# EasyEDA Pro project GD32F103C8T6 最小系統.eprj

# Schematic Schematic1
Board Name: Board1; Create Date: 2025-01-16; Page Name: P1; Project Name: GD32F103C8T6 最小系統; Schematic Name: Schematic1; Update Date: 2025-01-16; Company: 嘉立创EDA; Page Size: A4; Version: V1.0
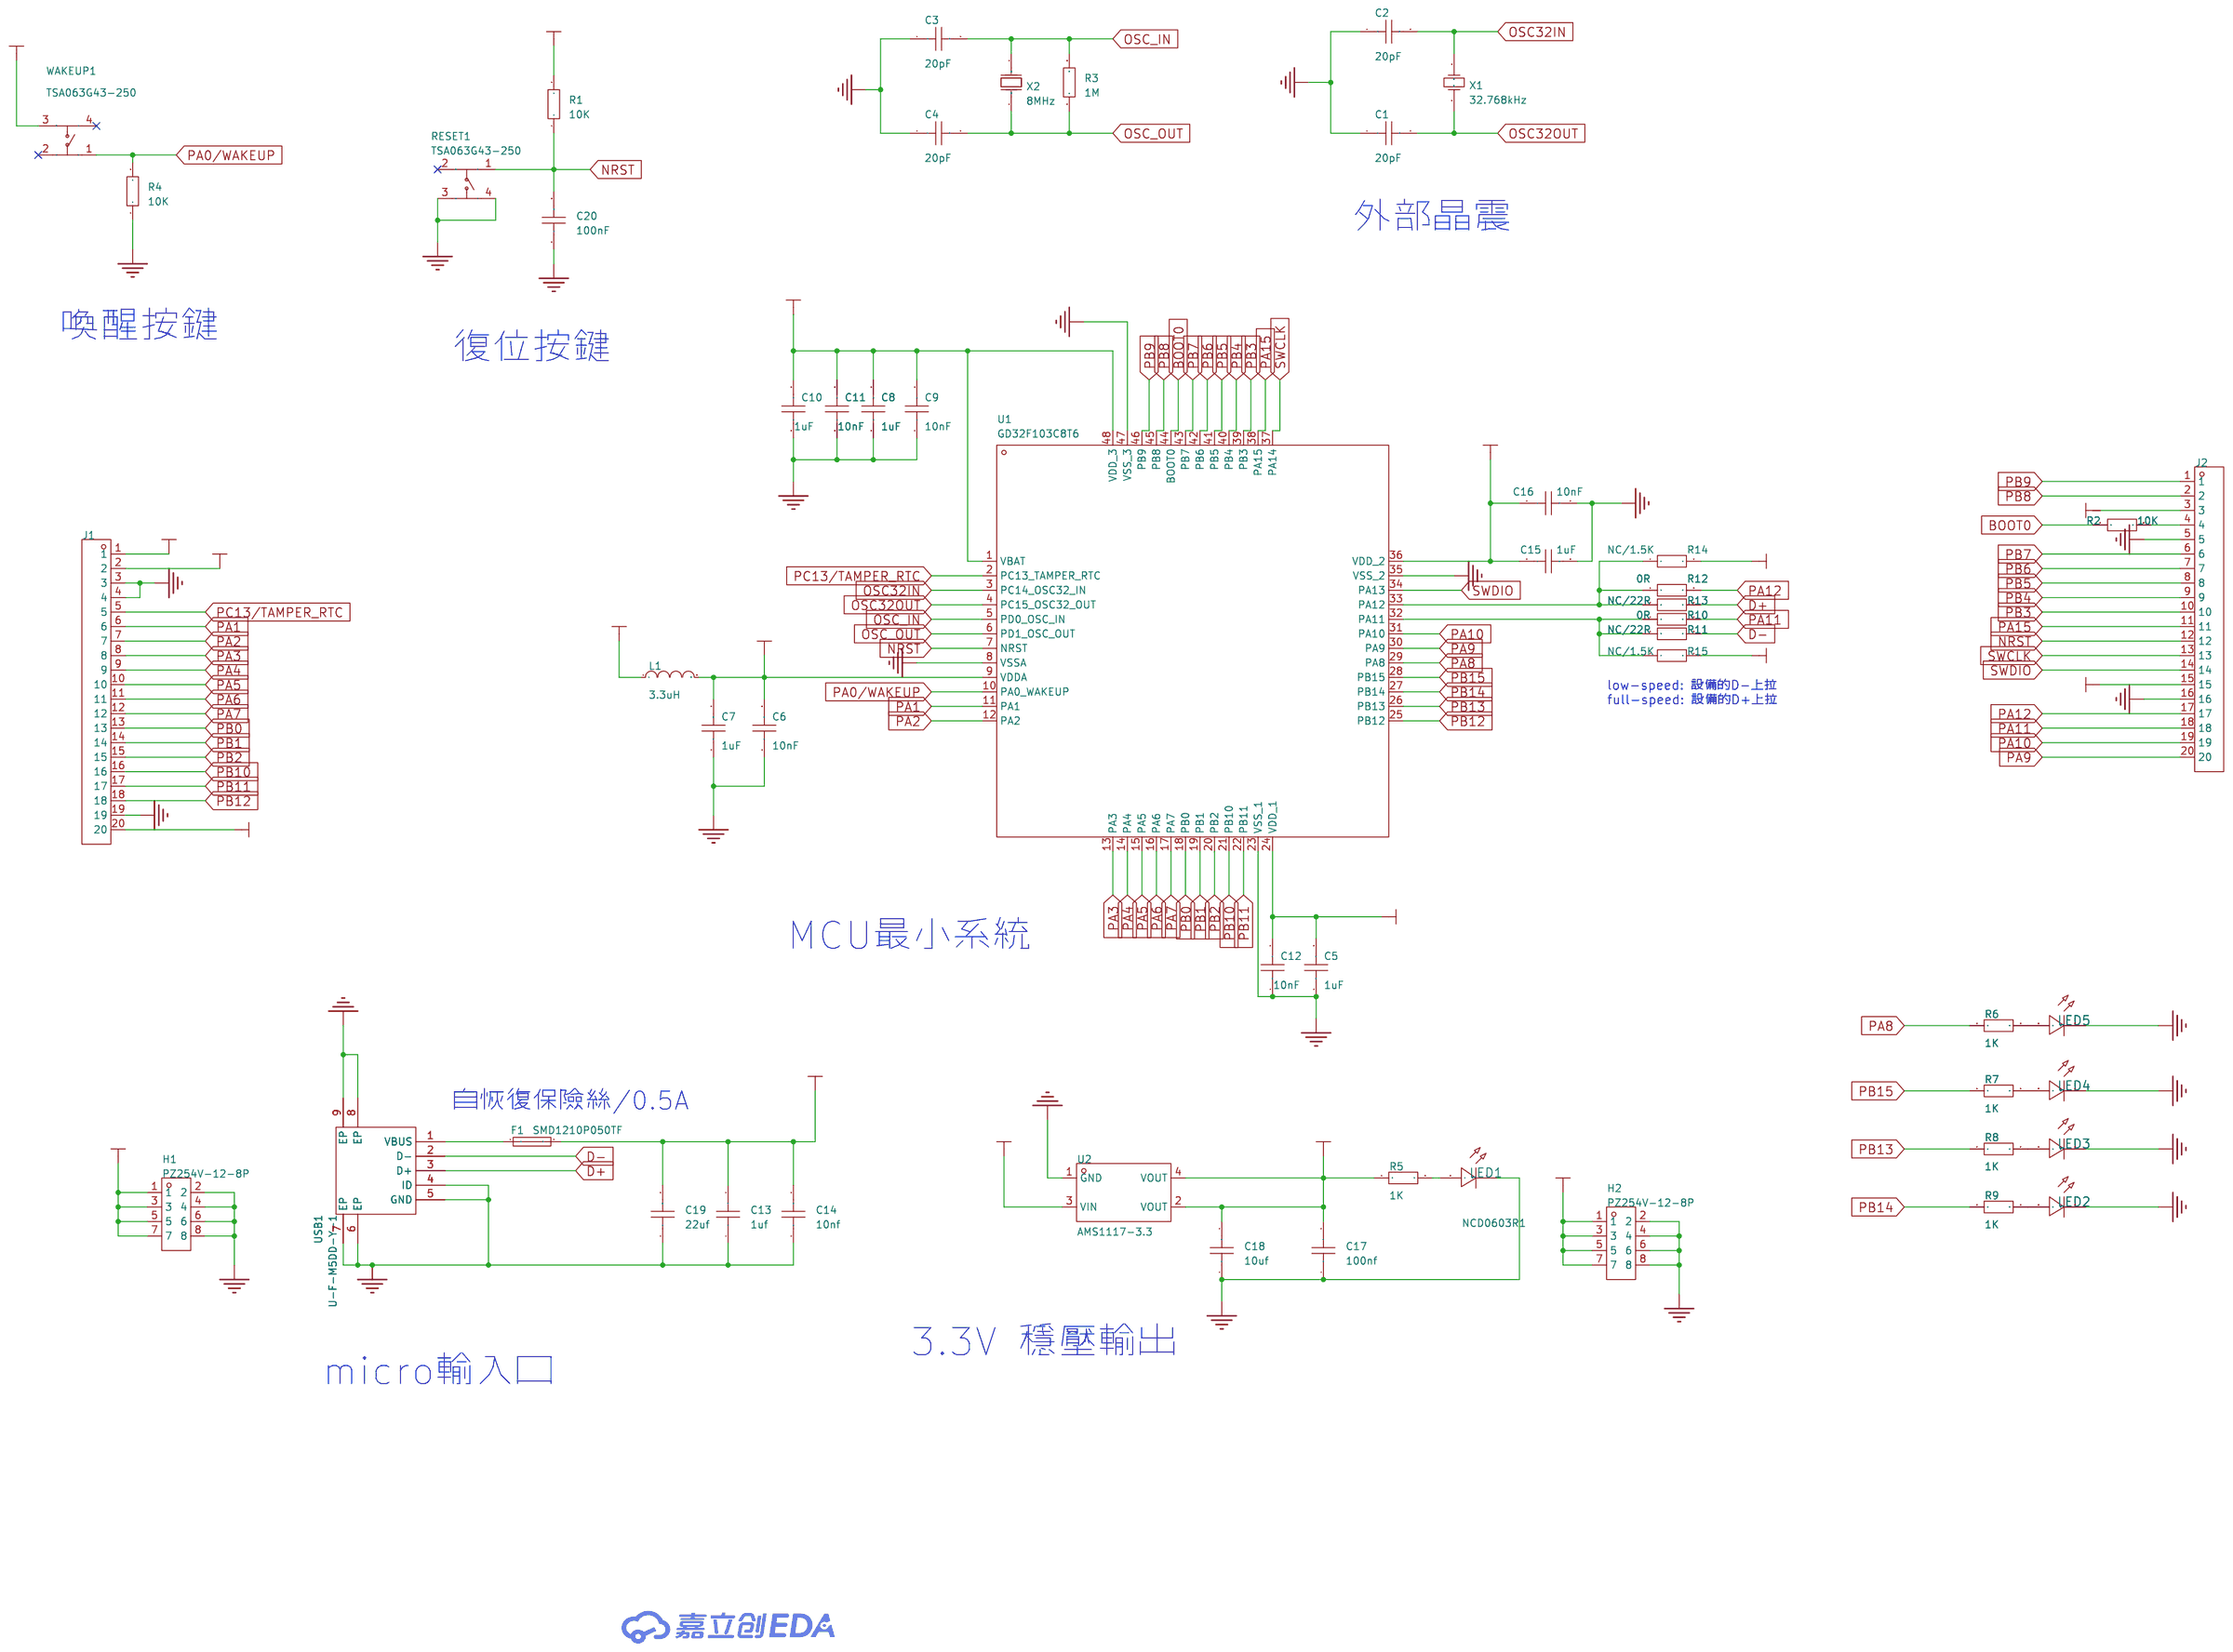
[diagram p0: schematic sheet]

## Parts
C1  20pF  [C0603]
C2  20pF  [C0603]
C3  20pF  [C0603]
C4  20pF  [C0603]
C5  1uF  [C0603]
C6  10nF  [C0603]
C7  1uF  [C0603]
C8  1uF  [C0603]
C9  10nF  [C0603]
C10  1uF  [C0603]
C11  10nF  [C0603]
C12  10nF  [C0603]
C13  1uf  [C0603]
C14  10nf  [C0603]
C15  1uF  [C0603]
C16  10nF  [C0603]
C17  100nf  [C0603]
C18  10uf  [C0805]
C19  22uf  [C0805]
C20  100nF  [C0603]
F1  SMD1210P050TF  [F1210]
H1  PZ254V-12-8P  [HDR-TH_8P-P2.54-V-M-R2-C4-S2.54]
H2  PZ254V-12-8P  [HDR-TH_8P-P2.54-V-M-R2-C4-S2.54]
J1  -  [HDR-TH_20P-P2.54-V-M-1]
J2  -  [HDR-TH_20P-P2.54-V-M-1]
L1  3.3uH  [L0603]
LED1  NCD0603R1  [LED0603-RD_RED]
LED2  NCD0603R1  [LED0603-RD_RED]
LED3  NCD0603R1  [LED0603-RD_RED]
LED4  NCD0603R1  [LED0603-RD_RED]
LED5  NCD0603R1  [LED0603-RD_RED]
R1  10K  [R0603]
R2  10K  [R0603]
R3  1M  [R0603]
R4  10K  [R0603]
R5  1K  [R0603]
R6  1K  [R0603]
R7  1K  [R0603]
R8  1K  [R0603]
R9  1K  [R0603]
R10  0R  [R0603]
R11  NC/22R  [R0603]
R12  0R  [R0603]
R13  NC/22R  [R0603]
R14  NC/1.5K  [R0603]
R15  NC/1.5K  [R0603]
RESET1  TSA063G43-250  [KEY-SMD_4P-L6.0-W6.0-P4.50-LS10.0]
U1  GD32F103C8T6  [TQFP-48_L7.0-W7.0-P0.50-LS9.0-BL]
U2  AMS1117-3.3  [SOT-223-3_L6.5-W3.4-P2.30-LS7.0-BR]
USB1  U-F-M5DD-Y-1  [MICRO-USB-SMD_U-F-M5DD-Y-1]
WAKEUP1  TSA063G43-250  [KEY-SMD_4P-L6.0-W6.0-P4.50-LS10.0]
X1  32.768kHz  [OSC-TH_BD3.1-P0.8-D0.3]
X2  8MHz  [OSC-TH_L10.0-W4.5-P5.00]

## Library data of the parts
C1-C20 = CAP_0603: Supplier Footprint: 0603
F1 = SMD1210P050TF: LCSC Part Name: 0.50A 自恢复型; Supplier Part: C15997; Manufacturer: RUILON(瑞隆源); Supplier Footprint: 1210; JLCPCB Part Class: 扩展库; Datasheet: https://atta.szlcsc.com/upload/public/pdf/source/20200427/C15997_F0890E2A0329AD76630862C098BA0840.pdf; Supplier: LCSC; Operating Voltage (Max): 13.2V; Current Rating (Max): 100A; Hold Current: 500mA; Trip Current: 1A
H1 H2 = PZ254V-12-8P: LCSC Part Name: 间距:2.54mm 2x4P 直插 方针; Supplier Part: C492421; Manufacturer: XFCN(兴飞); Supplier Footprint: 插件,P=2.54mm; JLCPCB Part Class: 扩展库; Datasheet: https://atta.szlcsc.com/upload/public/pdf/source/20200309/C492421_DC8A206AF99CD7755BD4A5B0BC48200B.pdf; Supplier: LCSC; Pin Structure: 2x4P; Pitch: 2.54mm; Row Spacing: 2.54mm; Circluar Pins/Square Pins: 方针; Mounting Type: 直插; Number of Rows: 双排; Number of Pins: 8P; Length of Mating Pin: 6mm; Insulation Height: 2.5mm; Length of End Connection Pin: 3mm; Contact Material: 黄铜; Operating Temperature Range: -40℃~+105℃; Color: 黑色
J1 J2 = HDR-M_2.54_1x20P: Supplier Part: C50981; Supplier Footprint: 插件
L1 = L_0603
LED1-LED5 = NCD0603R1_C84263: Supplier Part: C84263; Manufacturer: 国星光电; Supplier Footprint: 0603; JLCPCB Part Class: Extended Part; Datasheet: https://atta.szlcsc.com/upload/public/pdf/source/20200820/C84263_DABC6A75E58F576973B407FDBA283D60.pdf; Supplier: LCSC; Emitted Color: 红色; Forward Voltage (VF): 1.6V~2.6V; Power Dissipation: 65mW; Forward Current: 20mA; Dominant Wavelength: 615nm~630nm; Diode Configuration: 独立二极管; Lens Color: 无色透明透镜; Luminous Intensity: 80mcd~220mcd; Viewing Angle: 130°; Operating Temperature: -30℃~+85℃
R1-R15 = Res_0603: Supplier Footprint: 0603
RESET1 WAKEUP1 = TSA063G43-250: LCSC Part Name: 6.1*6.1*4.3mm 立贴 轻触开关; Supplier Part: C294564; Manufacturer: BRIGHT(博瑞泰); Supplier Footprint: SMD; JLCPCB Part Class: Extended Part; Datasheet: https://atta.szlcsc.com/upload/public/pdf/source/20181029/C294570_15EFF1F4D215547575AD6307D8A439BB.pdf; Supplier: LCSC; Circuit: 单刀单掷; Actuator Style: 圆形按钮; Operating Force: 250gf; Mounting Style: 立贴; Switch Length: 6.1mm; Switch Width: 6.1mm; Switch Height: 4.3mm; Strike Gundam: 不带; Contact Current: 50mA; Voltage Rating (DC): 12V; Insulation Resistance: 100MΩ; Actuator/Cap Color: 黑色; With Lamp: 无; Pin Style: 鸥翼型; Mechanical Life: 5万次; Operating Temperature: -25℃~+70℃
U1 = GD32F103C8T6: LCSC Part Name: Arm® Cortex®-M3 32-bit MCU; Supplier Part: C77994; Manufacturer: GigaDevice(兆易创新); Supplier Footprint: LQFP-48(7x7); JLCPCB Part Class: Extended Part; Datasheet: https://atta.szlcsc.com/upload/public/pdf/source/20160910/1473490296871.pdf; Supplier: LCSC; CPU Core: CM3; Program Storage Size: 64KB; RAM Size: 20KB; GPIO Ports Number: 37; Operating Voltage Range: 2.6V~3.6V; CPU Maximum Speed: 108MHz; Program Memory Type: FLASH; Operating Temperature Range: -40℃~+85℃; ADC (Bit): 12bit; PWM (Bit): 16bit; 16Bit Timer: 3; CAN: 1; UART/USART: 3; I2C: 2; SPI: 2; Universal Serial Bus: 有; Peripheral/Function: 片载温度传感器；DMA；看门狗；LIN总线协议；PWM；IrDA；SDIO；RTC实时时钟; Watchdog: 有; Real-Time Clock: 有; Infrared Data Association: 有; Secure Digital Input and Output: 有; Direct Memory Access: 有; Internal Oscillator: 有
U2 = AMS1117-3.3_C6186: 输出类型:固定;最大输入电压:-;输出电压:3.3V;最大输出电流:1A;电源纹波抑制比(PSRR):72dB@(120Hz);输出极性:正极;; LCSC Part Name: 输出3.3V 1A; Supplier Part: C6186; Manufacturer: AMS; Supplier Footprint: SOT-223; JLCPCB Part Class: Basic Part; Datasheet: https://atta.szlcsc.com/upload/public/pdf/source/20180727/C6186_7A095716F0823C02F1997A905E26C086.pdf; Supplier: LCSC; Output Type: 固定; Output Voltage: 3.3V; MAX Output Current: 1A; Power Supply Rejection Ratio (PSRR): 72dB@(120Hz); Dropout Voltage: 1.3V@(800mA); Output Polarity: 正极; Number of Outputs: 1
USB1 = U-F-M5DD-Y-1: LCSC Part Name: Micro-B 母; Supplier Part: C91467; Manufacturer: 韩国韩荣; Supplier Footprint: SMD; JLCPCB Part Class: Extended Part; Datasheet: https://atta.szlcsc.com/upload/public/pdf/source/20190321/C91467_7D0E0328BDB3D0105DB79E7E785438EE.pdf; Supplier: LCSC; Connector Type: Micro-B; Standard: USB 2.0; Gender: 母; Number of Ports: 1; Number of Contacts: 5P; Current Rating - Power (Max): 1A
X1 = X308032768KGB2SC: LCSC Part Name: 32.768kHz ±10ppm 12.5pF YT-38; Supplier Part: C52082; Manufacturer: YXC(扬兴晶振); Supplier Footprint: DT-38; JLCPCB Part Class: Extended Part; Datasheet: https://atta.szlcsc.com/upload/public/pdf/source/20240329/231E1A1EB7C875CD193DBE6664A3DE3A.pdf; Supplier: LCSC; Crystal Type: 直插晶振; Normal temperature Frequency Tolerance: ±10ppm; External load capacitor: 12.5pF; Operating Temperature: -20℃~+70℃
X2 = X49SD8MSD2SC: LCSC Part Name: 8MHz ±20ppm 20pF; Supplier Part: C21263; Manufacturer: YXC(扬兴晶振); Supplier Footprint: HC-49S; JLCPCB Part Class: 扩展库; Datasheet: https://atta.szlcsc.com/upload/public/pdf/source/20240329/977D7F2434F98B2BE33270BB9FF3D86D.pdf; Supplier: LCSC; Crystal Type: 直插晶振; Normal temperature Frequency Tolerance: ±20ppm; External load capacitor: 20pF; Frequency Stability(Full temperature range): ±30ppm; Operating Temperature: -20℃~+70℃

## Nets
GND: C1.1 C2.1 C3.1 C4.1 C5.1 C6.1 C7.1 C8.1 C9.1 C10.1 C11.1 C12.1 C13.1 C14.1 C15.2 C16.2 C17.1 C18.1 C19.1 C20.1 H1.2 H1.4 H1.6 H1.8 H2.2 H2.4 H2.6 H2.8 J1.3 J1.4 J1.19 J2.5 J2.16 LED1.1(C) LED2.1(C) LED3.1(C) LED4.1(C) LED5.1(C) R4.1 RESET1.3 RESET1.4 U1.8(VSSA) U1.23(VSS_1) U1.35(VSS_2) U1.47(VSS_3) U2.1(GND) USB1.4(ID) USB1.5(GND) USB1.6(EP) USB1.7(EP) USB1.8(EP) USB1.9(EP)
VCC_3V3: C5.2 C8.2 C9.2 C10.2 C11.2 C12.2 C15.1 C16.1 C17.2 C18.2 H2.1 H2.3 H2.5 H2.7 J1.1 J1.20 J2.3 J2.15 L1.1 R1.2 R5.1 R14.2 R15.2 U1.1(VBAT) U1.24(VDD_1) U1.36(VDD_2) U1.48(VDD_3) U2.2(VOUT) U2.4(VOUT) WAKEUP1.3
VDDA: C6.2 C7.2 J1.2 L1.2 U1.9(VDDA)
VIN_5V: C13.2 C14.2 C19.2 F1.2 H1.1 H1.3 H1.5 H1.7 U2.3(VIN)
BOOT0: R2.1 U1.44(BOOT0)
D+: R13.2 USB1.3(D+)
D-: R11.2 USB1.2(D-)
NRST: C20.2 J2.12 R1.1 RESET1.1 U1.7(NRST)
OSC32IN: C2.2 U1.3(PC14_OSC32_IN) X1.1(OSC1)
OSC32OUT: C1.2 U1.4(PC15_OSC32_OUT) X1.2(OSC2)
OSC_IN: C3.2 R3.2 U1.5(PD0_OSC_IN) X2.2(OSC2)
OSC_OUT: C4.2 R3.1 U1.6(PD1_OSC_OUT) X2.1(OSC1)
PA0/WAKEUP: R4.2 U1.10(PA0_WAKEUP) WAKEUP1.1
PA1: J1.6 U1.11(PA1)
PA2: J1.7 U1.12(PA2)
PA3: J1.8 U1.13(PA3)
PA4: J1.9 U1.14(PA4)
PA5: J1.10 U1.15(PA5)
PA6: J1.11 U1.16(PA6)
PA7: J1.12 U1.17(PA7)
PA8: R6.1 U1.29(PA8)
PA9: J2.20 U1.30(PA9)
PA10: J2.19 U1.31(PA10)
PA11: J2.18 R10.2
PA12: J2.17 R12.2
PA15: J2.11 U1.38(PA15)
PB0: J1.13 U1.18(PB0)
PB1: J1.14 U1.19(PB1)
PB2: J1.15 U1.20(PB2)
PB3: J2.10 U1.39(PB3)
PB4: J2.9 U1.40(PB4)
PB5: J2.8 U1.41(PB5)
PB6: J2.7 U1.42(PB6)
PB7: J2.6 U1.43(PB7)
PB8: J2.2 U1.45(PB8)
PB9: J2.1 U1.46(PB9)
PB10: J1.16 U1.21(PB10)
PB11: J1.17 U1.22(PB11)
PB12: J1.18 U1.25(PB12)
PB13: R8.1 U1.26(PB13)
PB14: R9.1 U1.27(PB14)
PB15: R7.1 U1.28(PB15)
PC13/TAMPER_RTC: J1.5 U1.2(PC13_TAMPER_RTC)
SWCLK: J2.13 U1.37(PA14)
SWDIO: J2.14 U1.34(PA13)
$1N505: LED1.2(A) R5.2
$1N1125: F1.1 USB1.1(VBUS)
$1N3914: R12.1 R13.1 R14.1 U1.33(PA12)
$1N3945: R10.1 R11.1 R15.1 U1.32(PA11)
$1N6882: J2.4 R2.2
$1N7531: LED5.2(A) R6.2
$1N7558: LED4.2(A) R7.2
$1N7585: LED3.2(A) R8.2
$1N7612: LED2.2(A) R9.2

Not connected (* = marked no-connect by the designer): RESET1 2*; WAKEUP1 2* 4*

## Notes on the sheet
- 外部晶震
- 喚醒按鍵
- 復位按鍵
- low-speed: 設備的D-上拉
- full-speed: 設備的D+上拉
- MCU最小系統
- 自恢復保險絲/0.5A
- 3.3V 穩壓輸出
- micro輸入口

# Board PCB1
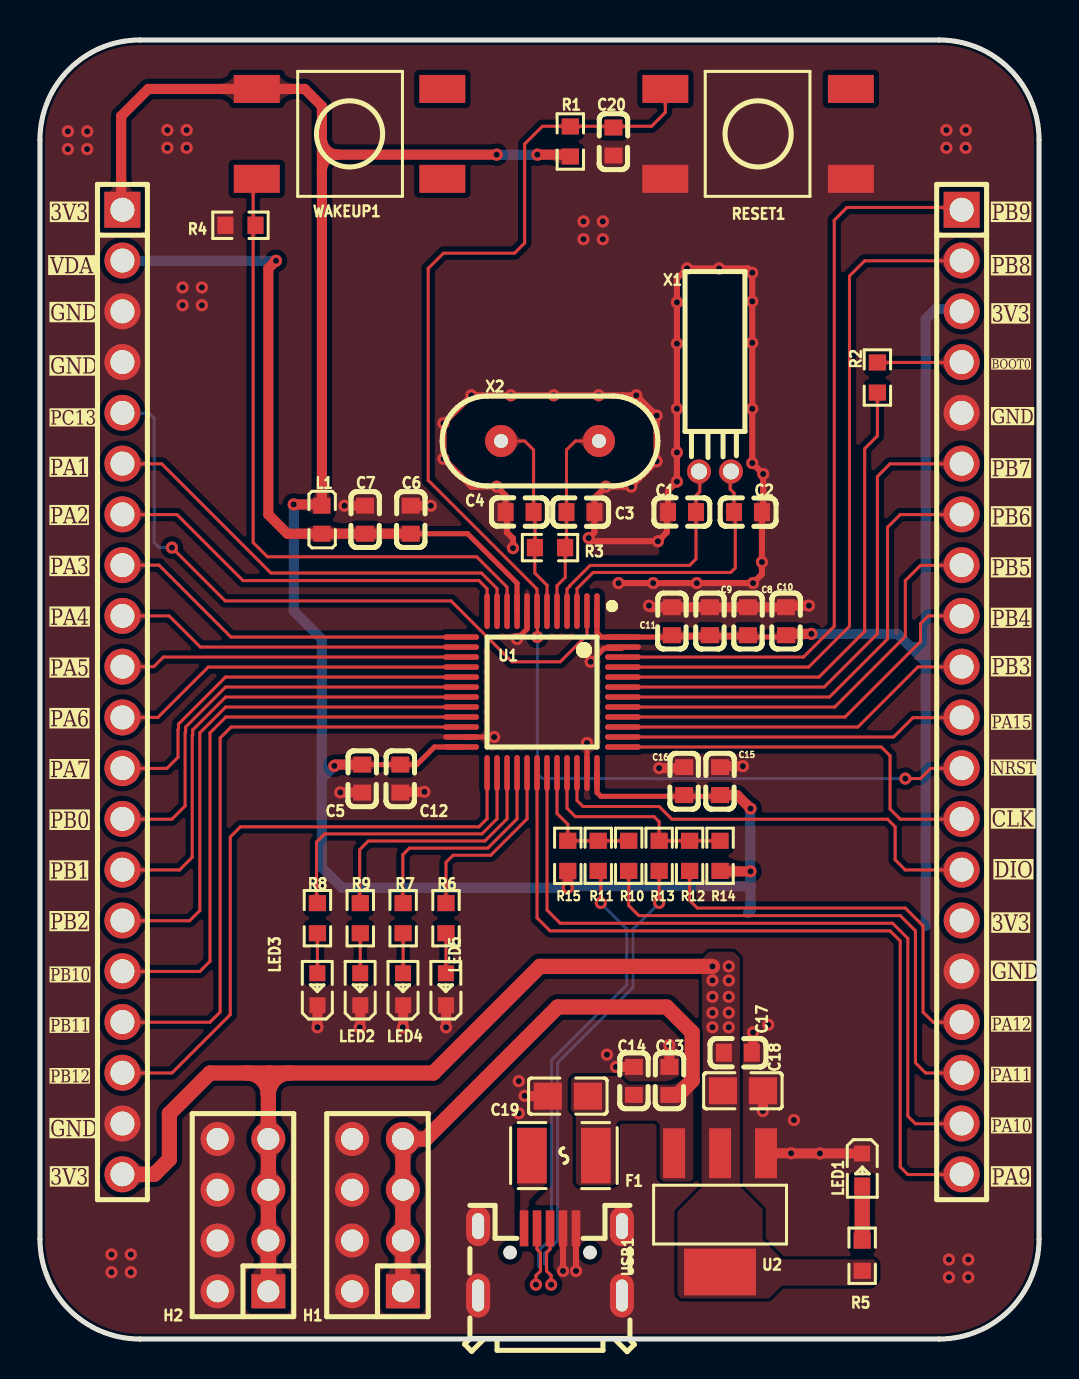
[diagram p1: board, top side]
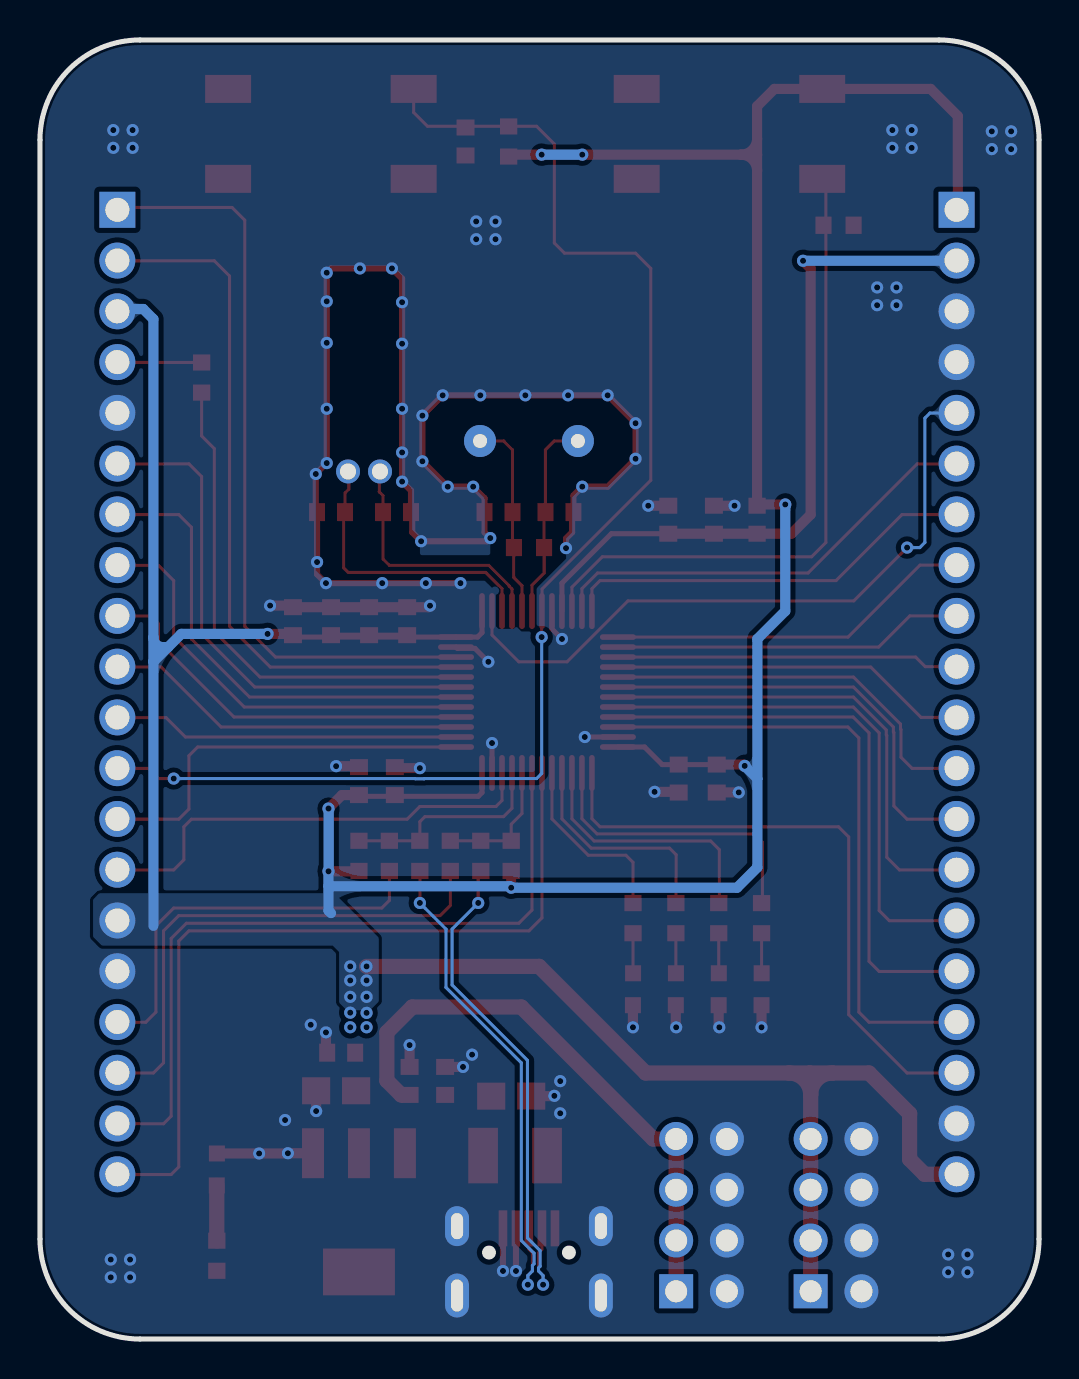
[diagram p2: board, bottom side, seen from below]

Outline 50 x 65 mm; copper layers: Top Layer, Bottom Layer. Coordinates in mm from the lower left corner of the outline.
Outline path: 0,60 0,5 arc(1.46,1.46) 5,0 45,0 arc(48.54,1.46) 50,5 50,60 arc(48.54,63.54) 45,65 5,65 arc(1.46,63.54) 0,60
Stack: Top Layer 0.035mm / Dielectric1 1.51mm FR4 er 4.5 / Bottom Layer 0.035mm

## Design rules (mm)
net GND: pwr
net VCC_3V3: pwr
net VDDA: pwr
net VIN_5V: pwr
net $1N1125: pwr
net D-: DP1
net D+: DP1
template: 自定义配置
spacing copperThickness1oz (default): track to track 0.203, other pairs 0.152 to 0.3
spacing copperThickness2oz: track to track 0.203, other pairs 0.152 to 0.3
track width copperThickness1oz (default): min 0.152, default 0.152, max 2.54
track width copperThickness2oz: min 0.152, default 0.254, max 2.54
track width pwr: min 0.254, default 0.508, max 2.54
differential pair differentialPair (default): width min 0.152, default 0.152, max 0.152; gap min 0.152, default 0.152
via viaSize (default): diameter min 0.5, default 0.61, max 10; hole min 0.3, default 0.305, max 6.299
net class pwr uses pwr
net GND uses pwr
net VCC_3V3 uses pwr
net VDDA uses pwr
net VIN_5V uses pwr
net $1N1125 uses pwr

## Placement (name value [footprint] x y rotation side)
C1  20pF  [C0603]  32.13 41.38 0 top
C2  20pF  [C0603]  35.43 41.38 180 top
C3  20pF  [C0603]  27.05 41.38 180 top
C4  20pF  [C0603]  24 41.38 0 top
C5  1uF  [C0603]  16.13 28.04 90 top
C6  10nF  [C0603]  18.56 41 270 top
C7  1uF  [C0603]  16.27 41 270 top
C8  1uF  [C0603]  35.43 35.92 270 top
C9  10nF  [C0603]  33.53 35.92 270 top
C10  1uF  [C0603]  37.34 35.92 270 top
C11  10nF  [C0603]  31.62 35.92 270 top
C12  10nF  [C0603]  18.03 28.04 90 top
C13  1uf  [C0603]  31.5 12.91 270 top
C14  10nf  [C0603]  29.72 12.91 270 top
C15  1uF  [C0603]  34.04 27.92 90 top
C16  10nF  [C0603]  32.24 27.92 90 top
C17  100nf  [C0603]  34.92 14.33 180 top
C18  10uf  [C0805]  35.18 12.42 180 top
C19  22uf  [C0805]  26.42 12.15 0 top
C20  100nF  [C0603]  28.7 59.92 90 top
F1  SMD1210P050TF  [F1210]  26.22 9.18 0 top
H1  PZ254V-12-8P  [HDR-TH_8P-P2.54-V-M-R2-C4-S2.54]  16.89 6.2 90 top
H2  PZ254V-12-8P  [HDR-TH_8P-P2.54-V-M-R2-C4-S2.54]  10.16 6.2 90 top
J1  -  [HDR-TH_20P-P2.54-V-M-1]  4.13 32.37 270 top
J2  -  [HDR-TH_20P-P2.54-V-M-1]  46.13 32.37 270 top
L1  3.3uH  [L0603]  14.11 41 270 top
LED1  NCD0603R1  [LED0603-RD_RED]  41.15 8.48 270 top
LED2  NCD0603R1  [LED0603-RD_RED]  16.03 17.5 90 top
LED3  NCD0603R1  [LED0603-RD_RED]  13.89 17.5 90 top
LED4  NCD0603R1  [LED0603-RD_RED]  18.17 17.5 90 top
LED5  NCD0603R1  [LED0603-RD_RED]  20.32 17.5 90 top
R1  10K  [R0603]  26.54 59.92 270 top
R2  10K  [R0603]  41.91 48.11 90 top
R3  1M  [R0603]  25.53 39.6 0 top
R4  10K  [R0603]  10.03 55.73 0 top
R5  1K  [R0603]  41.15 4.17 90 top
R6  1K  [R0603]  20.32 21.06 270 top
R7  1K  [R0603]  18.17 21.06 270 top
R8  1K  [R0603]  13.89 21.06 270 top
R9  1K  [R0603]  16.03 21.06 270 top
R10  0R  [R0603]  29.46 24.18 270 top
R11  NC/22R  [R0603]  27.94 24.18 270 top
R12  0R  [R0603]  32.51 24.18 270 top
R13  NC/22R  [R0603]  30.99 24.18 270 top
R14  NC/1.5K  [R0603]  34.04 24.18 270 top
R15  NC/1.5K  [R0603]  26.42 24.18 270 top
RESET1  TSA063G43-250  [KEY-SMD_4P-L6.0-W6.0-P4.50-LS10.0]  35.94 60.3 270 top
U1  GD32F103C8T6  [TQFP-48_L7.0-W7.0-P0.50-LS9.0-BL]  25.13 32.37 180 top
U2  AMS1117-3.3  [SOT-223-3_L6.5-W3.4-P2.30-LS7.0-BR]  34.04 6.33 90 top
USB1  U-F-M5DD-Y-1  [MICRO-USB-SMD_U-F-M5DD-Y-1]  25.53 3.91 270 top
WAKEUP1  TSA063G43-250  [KEY-SMD_4P-L6.0-W6.0-P4.50-LS10.0]  15.49 60.3 90 top
X1  32.768kHz  [OSC-TH_BD3.1-P0.8-D0.3]  33.78 43.41 270 top
X2  8MHz  [OSC-TH_L10.0-W4.5-P5.00]  25.53 44.93 90 top

## Footprints (pads in the part's own frame, mm; a bottom-side part is the same pattern mirrored in y, then rotated)
C0603
  rect 0.8x0.9 smd: 1(-0.7,0) 2(0.7,0)
C0805
  rect 1.41x1.35 smd: 1(-1,0) 2(1,0)
F1210
  rect 1.485x2.781 smd: 1(-1.6,0) 2(1.6,0)
HDR-TH_8P-P2.54-V-M-R2-C4-S2.54
  rect 1.7x1.7 hole 1.1: 1(-3.81,-1.27)
  round 1.7 hole 1.1: 2(-3.81,1.27) 3(-1.27,-1.27) 4(-1.27,1.27) 5(1.27,-1.27) 6(1.27,1.27) 7(3.81,-1.27) 8(3.81,1.27)
HDR-TH_20P-P2.54-V-M-1
  rect 1.8x1.8 hole 1.2: 1(-24.13,0)
  round 1.8 hole 1.2: 2(-21.59,0) 3(-19.05,0) 4(-16.51,0) 5(-13.97,0) 6(-11.43,0) 7(-8.89,0) 8(-6.35,0) 9(-3.81,0) 10(-1.27,0) 11(1.27,0) 12(3.81,0) 13(6.35,0) 14(8.89,0) 15(11.43,0) 16(13.97,0) 17(16.51,0) 18(19.05,0) 19(21.59,0) 20(24.13,0)
KEY-SMD_4P-L6.0-W6.0-P4.50-LS10.0
  rect 1.4x2.3 smd: 1(-2.25,-4.643) 2(-2.25,4.643) 3(2.25,4.643) 4(2.25,-4.643)
L0603
  rect 0.8x0.864 smd: 1(-0.7,0) 2(0.7,0)
LED0603-RD_RED
  rect 0.8x0.8 smd: 1(-0.799,-0.004) 2(0.799,0.004)
MICRO-USB-SMD_U-F-M5DD-Y-1
  rect 1.8x0.43 smd: 1(-1.626,-1.3) 2(-1.626,-0.65) 3(-1.626,0) 4(-1.626,0.65) 5(-1.626,1.3)
  oval 2x1.2 hole 1.3x0.6: 6(-1.735,3.599) 8(-1.735,-3.599)
  oval 2.2x1.2 hole 1.6x0.6: 7(1.735,3.599) 9(1.735,-3.599)
OSC-TH_BD3.1-P0.8-D0.3
  round 1.2 hole 0.8: 1(0,0.8) 2(0,-0.8)
OSC-TH_L10.0-W4.5-P5.00
  round 1.6 hole 0.7: 1(0,2.45) 2(0,-2.45)
R0603
  rect 0.806x0.864 smd: 1(-0.753,0) 2(0.753,0)
SOT-223-3_L6.5-W3.4-P2.30-LS7.0-BR
  rect 2.5x1.1 smd: 1(2.97,-2.3) 2(2.97,0) 3(2.97,2.3)
  rect 2.34x3.6 smd: 4(-2.97,0)
TQFP-48_L7.0-W7.0-P0.50-LS9.0-BL
  oval 0.28x1.8 smd: 1(-2.75,-4.05) 2(-2.25,-4.05) 3(-1.75,-4.05) 4(-1.25,-4.05) 5(-0.75,-4.05) 6(-0.25,-4.05) 7(0.25,-4.05) 8(0.75,-4.05) 9(1.25,-4.05) 10(1.75,-4.05) 11(2.25,-4.05) 12(2.75,-4.05) 25(2.75,4.05) 26(2.25,4.05) 27(1.75,4.05) 28(1.25,4.05) 29(0.75,4.05) 30(0.25,4.05) 31(-0.25,4.05) 32(-0.75,4.05) 33(-1.25,4.05) 34(-1.75,4.05) 35(-2.25,4.05) 36(-2.75,4.05)
  oval 1.8x0.28 smd: 13(4.05,-2.75) 14(4.05,-2.25) 15(4.05,-1.75) 16(4.05,-1.25) 17(4.05,-0.75) 18(4.05,-0.25) 19(4.05,0.25) 20(4.05,0.75) 21(4.05,1.25) 22(4.05,1.75) 23(4.05,2.25) 24(4.05,2.75) 37(-4.05,2.75) 38(-4.05,2.25) 39(-4.05,1.75) 40(-4.05,1.25) 41(-4.05,0.75) 42(-4.05,0.25) 43(-4.05,-0.25) 44(-4.05,-0.75) 45(-4.05,-1.25) 46(-4.05,-1.75) 47(-4.05,-2.25) 48(-4.05,-2.75)

## Nets
As in the schematic, except:
PA0/WAKEUP: R4.2 U1.10 WAKEUP1.2

Pads without a net: RESET1 2; WAKEUP1 1 4

## Via types
v1: diameter 0.61, hole 0.305, Top Layer to Bottom Layer, 117 vias

## Routing (per net, layer and track width the routed paths; a pad name or vN(x,y) marks a point on that pad's centre or on a via; arc(x,y) is an arc through that point)
GND: length 112.4
  Top Layer w0.254: U1.47 29.11,34.56 28.23,34.56 v1(27.56,33.88) ; U1.23 v1(22.73,30.12) ; v1(23.88,35.03) 24.38,35.53 U1.8 ; U1.35 v1(27.38,29.82)
  Top Layer w0.305: USB1.5 v1(26.83,3.41) ; v1(23.67,39.57) 23.67,40.06 23.37,40.36 23.37,41.31 C4.1 23.3,42.2 v1(22.86,42.65) 21.59,42.65 v1(20.19,44.04) v1(20.19,45.82) v1(21.59,47.22) v1(23.57,47.22) v1(25.71,47.22) v1(27.96,47.22) v1(29.84,47.22) v1(30.86,46.2) v1(30.86,43.92) v1(29.59,42.65) v1(28.32,42.65) 27.75,42.08 27.75,40.36 v1(27.46,40.08) 27.62,39.92 v1(30.92,39.92) 31.37,40.36 31.37,41.31 31.43,41.37 31.43,42.46 v1(31.88,42.9) v1(31.88,44.36) v1(31.88,46.55) v1(31.88,49.8) v1(31.88,51.88) 31.88,53.06 v1(32.39,53.57) v1(33.99,53.57) 35.43,53.57 v1(35.65,53.35) v1(35.65,51.92) v1(35.65,49.85) v1(35.65,46.55) v1(35.65,43.83) v1(36.2,43.28) 36.2,41.44 C2.1 v1(36.13,38.88) 36.13,38.27 v1(35.69,37.82) v1(32.87,37.82) v1(30.69,37.82) v1(28.96,37.82) ; USB1.4 v1(26.18,3.41)
  Top Layer w0.508: LED4.1 18.18,15.61 v1(18.16,15.6) ; C7.1 v1(15.24,41.7) ; 16.24,27.35 v1(15.03,27.35) ; v1(19.24,27.38) 18.03,27.38 17.91,27.25 ; 37.53,36.57 37.66,36.7 v1(38.48,36.7) ; C14.1 v1(28.83,13.61) ; C17.1 35.69,14.39 v1(35.69,15.34) ; v1(16,15.6) 16.03,15.63 LED2.1 ; v1(30.48,36.69) 30.56,36.62 C9.1 C8.1 C10.1 ; LED5.1 v1(20.32,15.6) ; 32.19,28.56 v1(30.99,28.56) ; LED3.1 v1(13.89,15.6) ; C6.1 v1(19.56,41.7) ; C13.1 v1(31.5,14.71) ; C18.1 v1(36.18,11.41) ; 33.97,28.66 v1(35.18,28.66) ; v1(24.26,12.17) 24.27,12.15 C19.1 ; 36.46,9.3 v1(37.59,9.3) 37.6,9.28 v1(39.03,9.28) LED1.1 ; 37.4,36.7 37.41,36.69
  vias: v1(1.4,60.43) v1(1.4,59.54) v1(2.36,60.43) v1(2.36,59.54) v1(3.58,4.23) v1(3.58,3.34) v1(4.55,4.23) v1(4.55,3.34) v1(6.37,60.49) v1(6.37,59.6) v1(7.14,52.62) v1(7.14,51.73) v1(7.34,60.49) v1(7.34,59.6) v1(8.1,52.62) v1(8.1,51.73) v1(23.96,12.9) v1(23.96,11.29) v1(27.2,55.92) v1(27.2,55.03) v1(28.17,55.92) v1(28.17,55.03) v1(28.37,14.23) v1(36.45,15.72) v1(37.73,10.96) v1(45.36,60.49) v1(45.36,59.6) v1(45.49,3.98) v1(45.49,3.09) v1(46.33,60.49) v1(46.33,59.6) v1(46.46,3.98) v1(46.46,3.09)
VCC_3V3: length 222.2
  Top Layer w0.254: C5.2 C12.2 18.86,28.74 19.74,29.62 U1.24 ; C8.2 C9.2 C11.2 ; C10.2 37.24,35.12 U1.48 28.1,35.12 27.88,35.34 U1.1 ; C15.1 33.97,27.15 28.07,27.15 27.88,27.34 U1.36 ; 16.15,28.93 16.13,28.91
  Top Layer w0.508: v1(24.89,59.26) 26.45,59.26 R1.2 ; 34.04,23.42 34.06,23.4 v1(35.56,23.4) ; C10.2 37.4,35.28 v1(38.61,35.28) ; 14.11,58.46 14.11,59.26 ; 14.11,58.46 L1.1 14.05,41.76 v1(12.7,41.76) ; 14.11,58.46 arc(14.35,59.03) 14.92,59.26 ; 14.11,59.26 14.11,60.07 ; 14.11,59.26 14.92,59.26 ; C15.1 34.89,27.22 v1(35.56,26.54) ; 14.92,59.26 v1(22.86,59.26) ; 14.92,59.26 arc(14.35,59.5) 14.11,60.07 ; v1(26.42,22.58) 26.42,23.42 ; v1(14.73,28.68) 14.8,28.74 C5.2 ; 14.11,60.07 14.11,61.68 13.24,62.55 WAKEUP1.3 5.42,62.55 4.06,61.19 4.06,56.57 J1.1
  Top Layer w0.762: 11.43,12.22 H2.7 H2.5 H2.3 H2.1 ; 11.43,12.22 11.43,13.27 11.47,13.31 ; 11.43,12.22 arc(11.11,12.99) 10.34,13.31 ; 11.43,12.22 arc(11.75,12.99) 12.52,13.31 ; 12.52,13.31 11.47,13.31 ; 12.52,13.31 19.68,13.31 25.02,18.64 v1(33.65,18.64) ; 11.47,13.31 10.34,13.31 ; 10.34,13.31 8.51,13.31 6.48,11.28 6.48,8.99 5.73,8.24 J1.20
  Bottom Layer w0.508: 44.32,20.68 44.32,33.88 ; 44.32,33.88 44.32,35.09 ; 44.32,33.88 43.59,34.62 ; 43.59,34.62 43.85,34.62 arc(44.19,34.76) 44.32,35.09 ; 43.59,34.62 42.93,35.28 v1(38.61,35.28) ; 14.1,28.04 v1(14.73,28.68) ; 14.1,28.04 14.1,35.03 12.7,36.42 v1(12.7,41.76) ; 14.1,28.04 14.1,23.6 15.11,22.58 v1(26.42,22.58) 26.49,22.66 35.56,22.66 ; v1(22.86,59.26) v1(24.89,59.26) ; 35.56,22.66 v1(35.56,23.4) 35.55,23.41 35.55,26.53 v1(35.56,26.54) ; 35.56,22.66 35.56,21.44 35.43,21.31 ; 44.32,35.09 44.32,51.03 44.83,51.54 46.01,51.54 J2.3
  vias: v1(33.65,17.94) v1(33.65,17.12) v1(33.65,16.32) v1(33.65,15.6) v1(34.47,18.64) v1(34.47,17.94) v1(34.47,17.12) v1(34.47,16.33) v1(34.47,15.6)
VDDA: length 35.8
  Top Layer w0.254: U1.9 23.88,37.82 21.4,40.3 C6.2
  Top Layer w0.508: v1(11.81,53.95) 11.43,53.57 11.43,41.25 12.39,40.3 L1.2 C7.2 C6.2
  Bottom Layer w0.508: J1.2 4.14,53.95 v1(11.81,53.95)
VIN_5V: length 29.2
  Top Layer w0.762: H1.1 H1.3 H1.5 H1.7 19.3,10.01 25.91,16.61 31.37,16.61 32.64,15.34 32.64,12.93 31.92,12.21 C13.2
BOOT0: length 25.3
  Top Layer w0.152: R2.1 41.91,45.19 41.27,44.55 41.27,35.41 38.99,33.12 U1.44
D+: length 26.2
  Top Layer w0.152: v1(25.58,2.72) 25.58,3.18 25.35,3.41 25.35,4.31 25.53,4.49 USB1.3 ; 30.99,23.42 v1(30.99,21.82)
  Bottom Layer w0.152: v1(30.99,21.82) 29.68,20.51 29.68,17.59 25.91,13.82 25.91,4.93 25.27,4.29 25.27,3.76 25.35,3.68 25.35,3.41 25.58,3.18 v1(25.58,2.72)
D-: length 26.2
  Top Layer w0.152: v1(28.07,21.82) 28.07,23.3 27.94,23.42 ; v1(24.82,2.72) 24.82,3.18 25.05,3.41 25.05,4.31 24.88,4.49 USB1.2
  Bottom Layer w0.152: v1(28.07,21.82) 29.37,20.51 29.37,17.72 25.6,13.95 25.6,5.06 24.97,4.42 24.97,3.64 25.05,3.56 25.05,3.41 24.82,3.18 v1(24.82,2.72)
NRST: length 68
  Top Layer w0.152: 31.17,62.3 31.3,62.17 31.3,61.37 30.61,60.68 25.15,60.68 24.26,59.79 24.26,54.84 23.75,54.33 20.19,54.33 19.43,53.57 19.43,42.97 24.87,37.53 24.87,37.21 24.88,37.2 U1.7 24.89,36.41 24.89,35.15 ; J2.12 46.11,28.55 44.58,28.55 44.07,28.04 v1(43.31,28.04)
  Bottom Layer w0.152: v1(24.89,35.12) 24.89,28.3 25.15,28.04 30.76,28.04 30.77,28.03 31.21,28.03 31.22,28.04 v1(43.31,28.04)
OSC32IN: length 14.4
  Top Layer w0.152: U1.3 26.88,37.55 27.68,38.36 34.57,38.36 34.8,38.58 34.8,41.31 C2.2 34.73,42.33 34.54,42.52 34.54,43.37 X1.1
OSC32OUT: length 12.7
  Top Layer w0.152: X1.2 32.98,43.28 33.02,43.24 33.02,42.39 32.83,42.2 C1.2 32.83,39.03 32.51,38.71 27.54,38.71 26.52,37.7 26.52,37.67 26.38,37.53 U1.4
OSC_IN: length 10.2
  Top Layer w0.152: X2.2 26.8,44.93 26.35,44.49 C3.2 26.35,39.67 R3.2 26.29,39.59 26.29,38.11 25.88,37.69 U1.5 ; 26.53,39.6 26.53,39.48 26.54,39.47
OSC_OUT: length 10.2
  Top Layer w0.152: X2.1 24.26,44.93 24.7,44.49 C4.2 24.77,41.31 R3.1 24.77,39.59 24.77,38.33 25.38,37.72 U1.6 ; 25.02,39.59 25.03,39.6
PA0/WAKEUP: length 33.2
  Top Layer w0.152: U1.10 23.38,37.62 21.86,39.14 11.38,39.14 10.67,39.85 10.67,57.99 10.72,58.05 WAKEUP1.2
PA1: length 22.5
  Top Layer w0.152: J1.6 4.14,43.79 6.1,43.79 11.56,38.33 22.09,38.33 22.88,37.55 U1.11
PA2: length 20.9
  Top Layer w0.152: U1.12 22.38,37.54 21.97,37.95 10.16,37.95 6.86,41.25 4.14,41.25 J1.7
PA3: length 18.4
  Top Layer w0.152: U1.13 9.56,35.12 5.96,38.72 J1.8
PA4: length 17.6
  Top Layer w0.152: U1.14 8.02,34.62 6.46,36.18 J1.9
PA5: length 17.1
  Top Layer w0.152: J1.10 5.69,33.64 6.18,34.12 U1.15
PA6: length 18
  Top Layer w0.152: U1.16 8.42,33.62 5.9,31.1 J1.11
PA7: length 19.8
  Top Layer w0.152: J1.12 4.14,28.55 6.35,28.55 6.91,29.11 6.91,30.5 6.93,30.52 6.93,30.77 9.29,33.12 U1.17
PA8: length 9.3
  Top Layer w0.152: R6.1 20.32,23.85 20.68,24.21 22.56,24.21 24.38,26.02 U1.29
PA9: length 40.4
  Top Layer w0.152: J2.20 46.11,8.23 43.43,8.23 43.05,8.61 43.05,19.91 42.55,20.42 25.53,20.42 24.88,21.07 U1.30
PA10: length 37.3
  Top Layer w0.152: U1.31 25.38,21.46 26.03,20.8 42.67,20.8 43.43,20.04 43.43,11.15 43.81,10.77 46.11,10.77 J2.19
PA11: length 25.7
  Top Layer w0.152: J2.18 46.11,13.31 44.32,13.31 43.81,13.82 43.81,20.42 43.05,21.18 29.97,21.18 29.46,21.69 29.46,23.42
PA12: length 20.2
  Top Layer w0.152: J2.17 46.11,15.85 44.7,15.85 44.2,16.36 44.2,20.68 43.31,21.57 32.89,21.57 32.51,21.95 32.51,23.42
PA15: length 17.4
  Top Layer w0.152: J2.11 46.11,31.09 43.69,31.09 42.72,30.12 U1.38
PB0: length 22
  Top Layer w0.152: J1.13 4.14,26.01 6.6,26.01 7.26,26.67 7.26,30.35 7.29,30.37 7.29,30.62 9.29,32.62 U1.18
PB1: length 24.3
  Top Layer w0.152: U1.19 9.29,32.12 7.65,30.48 7.65,30.23 7.62,30.2 7.62,24.11 6.98,23.47 4.14,23.47 J1.14
PB2: length 26.6
  Top Layer w0.152: J1.15 4.14,20.93 7.49,20.93 8,21.44 8,30.33 9.3,31.62 U1.20
PB3: length 18.2
  Top Layer w0.152: U1.39 40.93,30.62 43.94,33.63 46.11,33.63 J2.10
PB4: length 19.6
  Top Layer w0.152: U1.40 40.29,31.12 44.07,34.9 44.07,35.79 44.46,36.18 J2.9
PB5: length 21.5
  Top Layer w0.152: J2.8 46.11,38.71 44.07,38.71 43.31,37.95 43.31,35.15 39.77,31.62 U1.41
PB6: length 24
  Top Layer w0.152: U1.42 39.51,32.12 42.42,35.03 42.42,40.62 43.05,41.25 46.11,41.25 J2.7
PB7: length 26.2
  Top Layer w0.152: J2.6 46.11,43.79 42.55,43.79 41.91,43.16 41.91,35.28 39.25,32.62 U1.43
PB8: length 35.6
  Top Layer w0.152: J2.2 46.11,53.95 41.27,53.95 40.51,53.19 40.51,35.66 38.47,33.62 U1.45
PB9: length 38.2
  Top Layer w0.152: J2.1 46.01,56.62 40.39,56.62 39.75,55.98 39.75,35.66 38.21,34.12 U1.46
PB10: length 28.9
  Top Layer w0.152: J1.16 4.14,18.39 8,18.39 8.51,18.9 8.51,30.33 9.3,31.12 U1.21
PB11: length 31.1
  Top Layer w0.152: U1.22 9.56,30.62 9.02,30.07 9.02,16.36 8.51,15.85 4.14,15.85 J1.17
PB12: length 31
  Top Layer w0.152: U1.25 22.38,26.04 21.97,25.63 10.03,25.63 9.52,25.12 9.52,16.23 6.6,13.31 4.14,13.31 J1.18
PB13: length 14.9
  Top Layer w0.152: U1.26 22.88,26.03 22.12,25.27 14.25,25.27 13.84,24.87 13.84,21.85 R8.1
PB14: length 13
  Top Layer w0.152: U1.27 23.38,26.03 22.27,24.92 16.43,24.92 16,24.49 16,21.84 R9.1
PB15: length 11.2
  Top Layer w0.152: R7.1 18.16,21.83 18.16,24.23 18.49,24.56 22.41,24.56 23.88,26.03 U1.28
PC13/TAMPER_RTC: length 33.8
  Top Layer w0.152: U1.2 27.38,35.23 26.03,33.88 23.62,33.88 20.57,36.93 9.27,36.93 v1(6.6,39.6)
  Bottom Layer w0.152: v1(6.6,39.6) 5.97,39.6 5.71,39.85 5.71,46.08 5.46,46.33 4.14,46.33 J1.5
SWCLK: length 20
  Top Layer w0.152: U1.37 42.11,29.62 42.55,29.19 42.55,26.52 43.05,26.01 46.11,26.01 J2.13
SWDIO: length 23
  Top Layer w0.152: U1.34 26.88,26.95 27.18,26.65 30.99,26.65 31.62,26.01 42.42,26.01 42.8,25.63 42.8,23.98 43.31,23.47 46.11,23.47 J2.14
$1N505: length 2.8
  Top Layer w0.762: LED1.2 41.15,4.92 R5.2
$1N3914: length 10.7
  Top Layer w0.152: R14.1 R12.1 R13.1 30.99,25.88 30.73,26.14 26.8,26.14 26.38,26.56 U1.33
$1N3945: length 6.7
  Top Layer w0.152: U1.32 25.88,26.3 26.42,25.76 R15.1 R11.1 R10.1
$1N6882: length 4.2
  Top Layer w0.152: J2.4 46.11,48.86 R2.2
$1N7531: length 2
  Top Layer w0.152: R6.2 20.32,18.3 LED5.2
$1N7558: length 2
  Top Layer w0.152: R7.2 18.17,18.3 LED4.2
$1N7585: length 2
  Top Layer w0.152: R8.2 13.89,18.3 LED3.2
$1N7612: length 2
  Top Layer w0.152: LED2.2 16.03,18.3 R9.2

## Copper pours and planes (outline as drawn; the poured copper is in the pictures)
GND on Top Layer: -3.43,67.54 58.04,67.54 58.04,-6.12 -3.43,-6.12
GND on Bottom Layer: -11.18,72.11 60.2,72.11 60.2,-9.8 -11.18,-9.8
GND on Bottom Layer: 34.62,29 48.55,29 48.55,20.42 34.62,20.42
VCC_3V3 on Top Layer: 37.11,3.88 36.07,4.93 36.07,6.45 34.92,7.6 34.92,14.76 34.64,15.04 33.53,15.04 33.22,14.73 33.22,7.65 33.27,7.6 32,6.33 32,2.26 32.13,2.13 36.45,2.13 37.08,2.77 41.57,2.77 41.81,3 41.81,3.76 41.68,3.88
VCC_3V3 on Top Layer: 33.23,18.98 33.53,19.28 34.67,19.28 34.92,19.03 34.92,14.32 33.23,14.32
VCC_3V3 on Bottom Layer: 33.15,20.04 35.31,22.2 46.99,22.2 47.24,21.95 47.24,20.17 46.86,19.79 35.31,19.79 34.92,19.41 34.92,16.87 34.61,16.55 33.53,16.55 33.15,16.93
VIN_5V on Top Layer: 26.92,7.85 26.92,11.25 26.67,11.5 26.67,12.93 26.8,13.06 28.95,13.06 29.37,12.63 32.59,12.63 32.59,8.06 32.51,7.98 31.24,7.98 31.11,8.1 31.11,10.77 30.86,11.02 28.96,11.02 28.76,10.83 28.76,7.86 28.57,7.78 26.99,7.78
$1N1125 on Top Layer: 24,4.67 24,7.6 23.88,7.72 23.88,10.57 25.38,10.57 25.38,7.8 24.51,6.93 24.51,4.64 24.03,4.64

Small or netless copper shapes (teardrops, artwork), in the pictures only: 276 on Top Layer, 24 on Bottom Layer

## Text on the board
Top Silkscreen Layer: BOOT0 | PB10 | PB11 | PB12 | PA15 | NRST | PA12 | PA11 | PA10 | PC13 | GND | 3V3 | VDA | PA1 | PA2 | PA3 | PA4 | PA5 | PA6 | PA7 | PB0 | PB1 | PB2 | PB9 | PB8 | PB7 | PB6 | PB5 | PB4 | PB3 | CLK | PA9 | DIO
